# Altium project 00001-2-HAR-A-01.PrjPcb (part 2 of 2)

## Sheet SCH-00001-AC-01.SchDoc
size A4; SheetNumber: 4; SheetTotal: 4
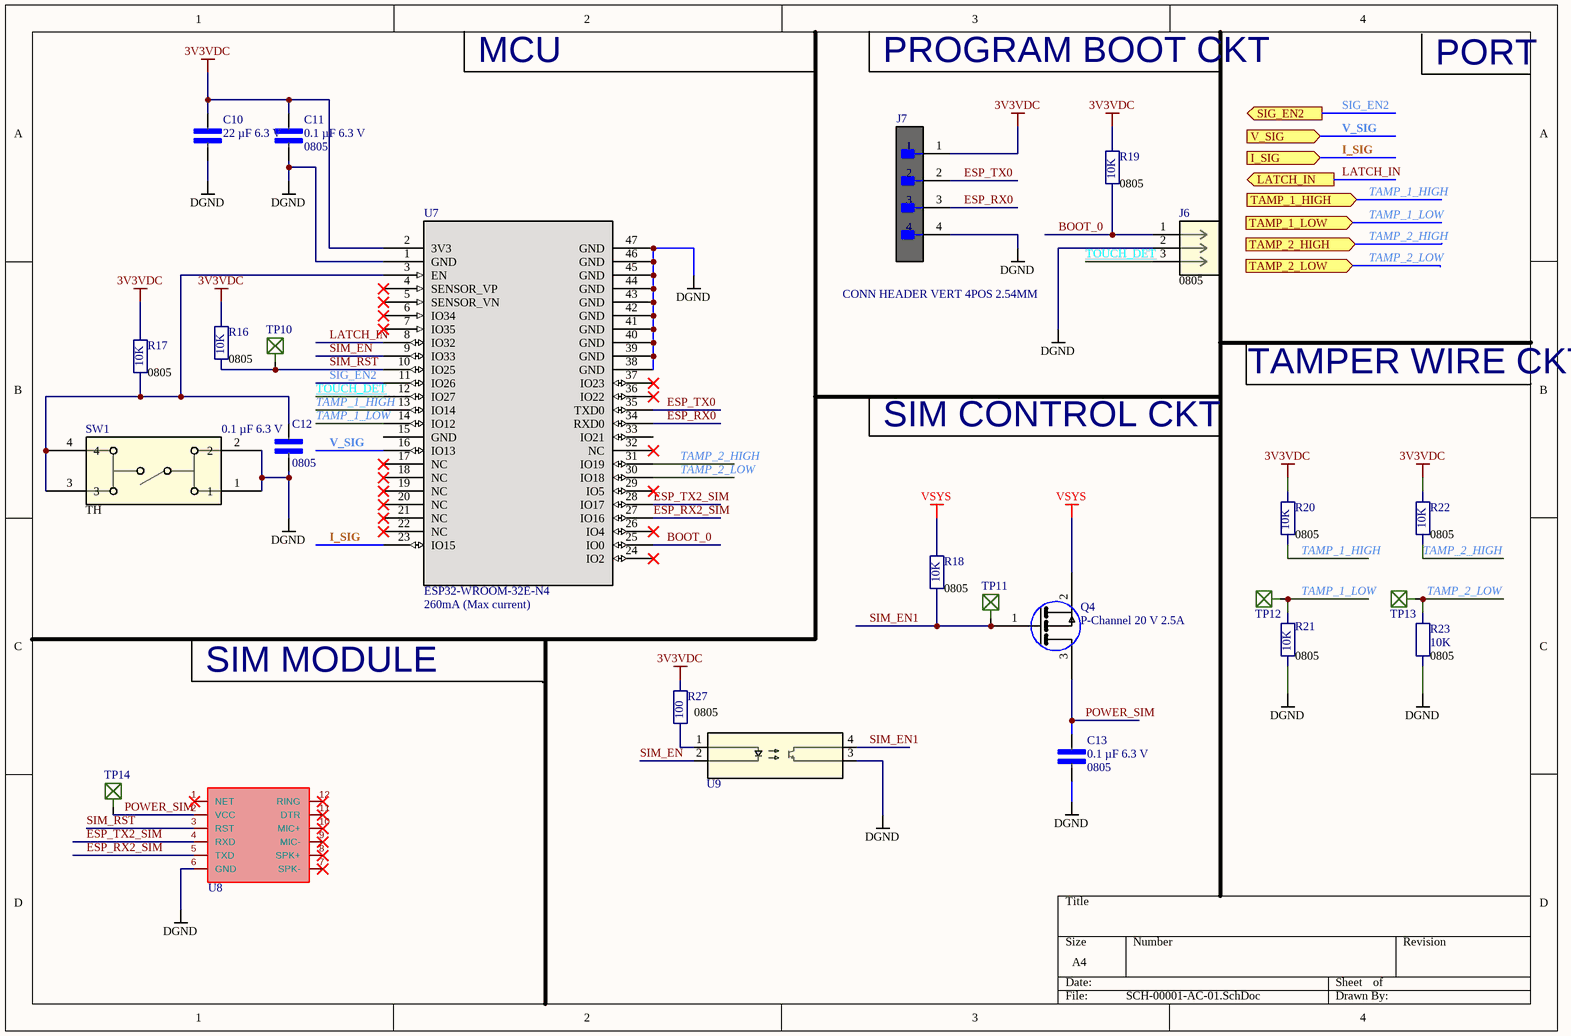
[diagram p3: SCH-00001-AC-01.SchDoc]

### Parts
C10  value 22 µF 6.3 V  [CAP0805]  (hidden comment: CL21A226KQCLRNC)
C11  value 0.1 µF 6.3 V  Value 2: 0805  [CAP0805]  (hidden comment: 08056D104KAT2A)
C12  value 0.1 µF 6.3 V  Value 2: 0805  [CAP0805]  (hidden comment: 08056D104KAT2A)
C13  value 0.1 µF 6.3 V  Value 2: 0805  [CAP0805]  (hidden comment: 08056D104KAT2A)
J6  Package: 0805  [CONN_PRPC003SAAN-RC_SUL]  (hidden comment: PRPC003SAAN-RC)
J7  value CONN HEADER VERT 4POS 2.54MM  [Amphenol_FCI_0_MFG]  (hidden comment: 68000-204HLF)
Q4  value P-Channel 20 V 2.5A  [SOT23_DMG2301U_DIO]  (hidden comment: DMG2301U-7)
R16  value 10K  Package: 0805  [RES0805]  (hidden comment: ERA-6AEB103V)
R17  value 10K  Package: 0805  [RES0805]  (hidden comment: ERA-6AEB103V)
R18  value 10K  Package: 0805  [RES0805]  (hidden comment: ERA-6AEB103V)
R19  value 10K  Package: 0805  [RES0805]  (hidden comment: ERA-6AEB103V)
R20  value 10K  Package: 0805  [RES0805]  (hidden comment: ERA-6AEB103V)
R21  value 10K  Package: 0805  [RES0805]  (hidden comment: ERA-6AEB103V)
R22  value 10K  Package: 0805  [RES0805]  (hidden comment: ERA-6AEB103V)
R23  value 10K  Package: 0805  [RES0805]  (hidden comment: ERA-6AEB103V)
R27  value 100  Package: 0805  [RES0805]  (hidden comment: ERJ-6GEYJ101V)
SW1  Package: TH  [SW4_1825910-E_TEC]  (hidden comment: 1-1825910-8)
TP10  TEST point  [TEST_POINT]  (value not drawn)
TP11  TEST point  [TEST_POINT]  (value not drawn)
TP12  TEST point  [TEST_POINT]  (value not drawn)
TP13  TEST point  [TEST_POINT]  (value not drawn)
TP14  TEST point  [TEST_POINT]  (value not drawn)
U7  Value1: 260mA (Max current)  [ESP32­WROOM­32E_EXP]  (hidden comment: ESP32-WROOM-32E-N4)
U8  SIM800L  [SIM800L-CORE]  (value not drawn)
U9  PC81710NIP1B  [SOP_PC8171_SCT-M]  (value not drawn)

### Ports
I_SIG (in, see SCH-00001-AA-01[2A], SCH-00001-AB-01[2D]), LATCH_IN (out, see SCH-00001-AA-01[2B], SCH-00001-AB-01[2D]), SIG_EN2 (out, see SCH-00001-AA-01[2B], SCH-00001-AB-01[2D]), TAMP_1_HIGH (in, see SCH-00001-AA-01[2A], SCH-00001-AB-01[2D]), TAMP_1_LOW (in, see SCH-00001-AA-01[2B], SCH-00001-AB-01[2D]), TAMP_2_HIGH (in, see SCH-00001-AA-01[2B], SCH-00001-AB-01[2D]), TAMP_2_LOW (in, see SCH-00001-AA-01[2B], SCH-00001-AB-01[2D]), V_SIG (in, see SCH-00001-AA-01[2A], SCH-00001-AB-01[2D])

### Nets
3V3VDC: C10.1(+) C11.1(+) J7.1 R16.2 R17.2 R19.2 R20.2 R22.2 R27.2 U7.2(3V3)
DGND: C10.2(-) C11.2(-) C12.2(-) C13.2(-) J6.2 J7.4 R21.1 R23.1 SW1.1 SW1.2 U7.1(GND) U7.38(GND) U7.39(GND) U7.40(GND) U7.41(GND) U7.42(GND) U7.43(GND) U7.44(GND) U7.45(GND) U7.46(GND) U7.47(GND) U8.6(GND) U9.3(EMITTER)
VSYS: Q4.2(2/S) R18.2
BOOT_0: J6.1 R19.1 U7.25(IO0)
ESP_RX0: J7.3 U7.34(RXD0)
ESP_RX2_SIM: U7.27(IO16) U8.5(TXD)
ESP_TX0: J7.2 U7.35(TXD0)
ESP_TX2_SIM: U7.28(IO17) U8.4(RXD)
I_SIG: U7.23(IO15) ; port I_SIG
LATCH_IN: U7.8(IO32) ; port LATCH_IN
POWER_SIM: C13.1(+) Q4.3(3/D) TP14.1(G) U8.2(VCC)
SIG_EN2: U7.11(IO26) ; port SIG_EN2
SIM_EN: U7.9(IO33) U9.2(CATHODE)
SIM_EN1: Q4.1(1/G) R18.1 TP11.1(G) U9.4(COLLECTOR)
SIM_RST: R16.1 TP10.1(G) U7.10(IO25) U8.3(RST)
TAMP_1_HIGH: R20.1 U7.13(IO14) ; port TAMP_1_HIGH
TAMP_1_LOW: R21.2 TP12.1(G) U7.14(IO12) ; port TAMP_1_LOW
TAMP_2_HIGH: R22.1 U7.31(IO19) ; port TAMP_2_HIGH
TAMP_2_LOW: R23.2 TP13.1(G) U7.30(IO18) ; port TAMP_2_LOW
TOUCH_DET: J6.3 U7.12(IO27)
V_SIG: U7.16(IO13) ; port V_SIG
NetC12_1: C12.1(+) R17.1 SW1.3 SW1.4 U7.3(EN)
NetR27_1: R27.1 U9.1(ANODE)

Not connected (* = marked no-connect by the designer): U7 4(SENSOR_VP)* 5(SENSOR_VN)* 6(IO34)* 7(IO35)* 15(GND) 17(NC)* 18(NC)* 19(NC)* 20(NC)* 21(NC)* 22(NC)* 24(IO2)* 26(IO4)* 29(IO5)* 32(NC)* 33(IO21) 36(IO22)* 37(IO23)*; U8 1(NET)* 7(SPK-)* 8(SPK+)* 9(MIC-)* 10(MIC+)* 11(DTR)* 12(RING)*

### Notes on the sheet
- MCU
- PROGRAM BOOT CKT
- PORT
- TAMPER WIRE CKT
- SIM CONTROL CKT
- SIM MODULE

### Library data of the parts
C10 = CL21A226KQCLRNC: 22 µF ±10% 6.3V Ceramic Capacitor X5R 0805 (2012 Metric); Manufacturer: Samsung Electro-Mechanics; FIT/NFIT: FIT; Value 2: 0805; Manufacturer Part no.: CL21A226KQCLRNC; Distributor 1: digikey; Distributor 1 Part no.: 478-08056D104KAT2ACT-ND; Price: ₹9.22; Price (Quantity): ₹2.81640100+); Date drawn: 03/9/2024; Drawn by: Varun Chakravarthy; Distributor 2: *; Distributor 2 part no.: *; Reference(datasheet): https://weblib.samsungsem.com/mlcc/mlcc-ec-data-sheet.do?partNumber=CL05Y105KP6VPN; ComponentLink1Description: Reference Product link; ComponentLink1URL: https://www.digikey.in/en/products/detail/samsung-electro-mechanics/CL21A226KQCLRNC/5961171; Supplier 1: Avnet; Supplier Part Number 1: CL21A226KQCLRNC
C11-C13 = 08056D104KAT2A: 0.1 µF ±10% 6.3V Ceramic Capacitor X5R 0805 (2012 Metric); Manufacturer: KYOCERA AVX; FIT/NFIT: FIT; Manufacturer Part no.: 08056D104KAT2A; Distributor 1: digikey; Distributor 1 Part no.: 478-08056D104KAT2ACT-ND; Price: ₹8.38; Price (Quantity): ₹2.12900(100+); Date drawn: 04/07/24; Drawn by: Varun Chakravarthy; Distributor 2: *; Distributor 2 part no.: *; Reference(datasheet): https://datasheets.kyocera-avx.com/cx5r.pdf; ComponentLink1Description: Reference Product link; ComponentLink1URL: https://www.digikey.in/en/products/detail/kyocera-avx/08056D104KAT2A/11568656; Supplier 1: Digikey; Supplier Part Number 1: 478-08056D104KAT2ACT-ND
J6 = PRPC003SAAN-RC: Connector Header Through Hole 3 position 0.100" (2.54mm); Manufacturer: Sullins Connector Solutions; Dranw by: Varun; FIT/NFIT: FIT; Manufacturer Part no.: PRPC003SAAN-RC; Distributor 1: Digikey; Distributor 1 Part no.: S1011EC-03-ND; Price: ₹36.88; Price (Quantity): ₹21.38250 (100+); Date drawn: 12/9/2024; Distributor 2: *; Distributor 2 part no.: *; Verified by: *; Reference(datasheet): https://mm.digikey.com/Volume0/opasdata/d220001/medias/docus/386/xRxCzzzSxxN-RC_ST_11635-B.pdf; ComponentLink1Description: Reference Product Link; ComponentLink1URL: https://www.digikey.in/en/products/detail/sullins-connector-solutions/PRPC003SAAN-RC/2775251?s=N4IgTCBcDaIAoCU4GEAMqDMBlAgjgcgLQLIgC6AvkA; Supplier 1: Digikey; Supplier Part Number 1: S1011EC-03-ND
J7 = 68000-204HLF: Connector Header Through Hole 4 position 0.100" (2.54mm); Manufacturer: Amphenol ICC (FCI); Dranw by: Varun; FIT/NFIT: FIT; Manufacturer Part no.: 68000-204HLF; Distributor 1: Digikey; Distributor 1 Part no.: 609-3255-ND; Price: ₹36.88; Price (Quantity): ₹20.97180 (100+); Date drawn: 3/9/2024; Distributor 2: *; Distributor 2 part no.: *; Verified by: *; Reference(datasheet): https://cdn.amphenol-cs.com/media/wysiwyg/files/documentation/datasheet/boardwiretoboard/bwb_bergstik.pdf; ComponentLink1Description: Reference Product Link; ComponentLink1URL: https://www.digikey.in/en/products/detail/amphenol-cs-fci/68000-204HLF/1878484?s=N4IgTCBcDaIGwA4AMKC0YkBYASAZAYiALoC%2BQA; Supplier 1: Avnet; Supplier Part Number 1: 28AH8822; Supplier 2: Arrow Electronics; Supplier Part Number 2: 68016-204HLF; Supplier 3: Arrow Electronics; Supplier Part Number 3: 68002-204HLF; Supplier 4: Arrow Electronics; Supplier Part Number 4: 68000-204HLF; Supplier 5: Arrow Electronics; Supplier Part Number 5: 68000-204HLF; Supplier 6: Newark; Supplier Part Number 6: 93K8020; Supplier 7: Avnet; Supplier Part Number 7: 84K6839
Q4 = DMG2301U-7: P-Channel 20 V 2.5A (Ta) 800mW (Ta) Surface Mount SOT-23-3; Manufacturer: Diodes Incorporated; FIT/NFIT: FIT; Manufacturer Part no.: DMG2301U-7; Distributor 1: digikey; Distributor 1 Part no.: DMG2301U-7DICT-ND; Price: ₹25.15; Price (Quantity): ₹9.06090(100+); Date drawn: 05/09/24; Drawn by: Varun Chakravarthy; Distributor 2: *; Distributor 2 part no.: *; Reference(datasheet): https://mm.digikey.com/Volume0/opasdata/d220001/medias/docus/645/DMG2301U.pdf; ComponentLink1Description: Reference Product Link; ComponentLink1URL: https://www.digikey.in/en/products/detail/murata-electronics/GRM21BR71A105KA01L/586695; Supplier 1: Future Electronics; Supplier Part Number 1: 5623319
R16-R23 = ERA-6AEB103V: 10 kOhms ±0.1% 0.125W, 1/8W Chip Resistor 0805 (2012 Metric) Automotive AEC-Q200 Thin Film; Manufacturer: Panasonic Electronic Components; Dranw by: Varun; FIT/NFIT: FIT; Manufacturer Part no.: ERA-6AEB103V; Distributor 1: Digikey; Distributor 1 Part no.: P10KDACT-ND; Price: ₹10.90; Price (Quantity): ₹5.89250 (100+); Date drawn: 1/9/2024; Distributor 2: *; Distributor 2 part no.: *; Verified by: *; Reference(datasheet): https://industrial.panasonic.com/cdbs/www-data/pdf/RDM0000/AOA0000C307.pdf; ComponentLink1Description: Reference Product Link; ComponentLink1URL: https://www.digikey.in/en/products/detail/panasonic-electronic-components/ERA-6AEB103V/1465773; Supplier 1: Future Electronics; Supplier Part Number 1: 5028531
R27 = ERJ-6GEYJ101V: 100 Ohms ±5% 0.125W, 1/8W Chip Resistor 0805 (2012 Metric) Automotive AEC-Q200 Thick Film; Manufacturer: Panasonic Electronic Components; Dranw by: Varun; FIT/NFIT: FIT; Manufacturer Part no.: ERJ-6GEYJ101V; Distributor 1: Digikey; Distributor 1 Part no.: P100ACT-ND; Price: ₹8.38; Price (Quantity): ₹1.76020(100+); Date drawn: 1/9/2024; Distributor 2: *; Distributor 2 part no.: *; Verified by: *; Reference(datasheet): https://industrial.panasonic.com/cdbs/www-data/pdf/RDA0000/AOA0000C301.pdf; ComponentLink1Description: Reference Product Link; ComponentLink1URL: https://www.digikey.in/en/products/detail/panasonic-electronic-components/ERJ-6GEYJ101V/89678; Supplier 1: Future Electronics; Supplier Part Number 1: 9028505
SW1 = 1-1825910-8: Tactile Switch SPST-NO Top Actuated Through Hole; Manufacturer: TE Connectivity ALCOSWITCH Switches; Dranw by: Varun; FIT/NFIT: FIT; Manufacturer Part no.: 1-1825910-8; Distributor 1: Digikey; Distributor 1 Part no.: 450-1647-ND; Price: ₹8.38; Price (Quantity): ₹6.53800(100+); Date drawn: 12/9/2024; Distributor 2: *; Distributor 2 part no.: *; Verified by: *; Reference(datasheet): https://www.te.com/usa-en/product-1-1825910-8.datasheet.pdf; ComponentLink1Description: Reference Product Link; ComponentLink1URL: https://www.digikey.in/en/products/detail/te-connectivity-alcoswitch-switches/1-1825910-8/1632533; Supplier 1: Future Electronics; Supplier Part Number 1: 3054607
TP10-TP14 = TP
U7 = ESP32-WROOM-32E-N4: Bluetooth, WiFi 802.11b/g/n, Bluetooth v4.2 +EDR, Class 1, 2 and 3 Transceiver Module 2.4GHz ~ 2.5GHz Integrated, Trace Surface Mount; Manufacturer: Espressif Systems; FIT/NFIT: FIT; Value2: 3.3V; Value: RF TXRX MOD BT BLE WIFI; Distributor 1: Digikey; Distributor 1 part no.: 1965-ESP32-WROOM-32E-N4CT-ND; Distributor 2 part no.: *; Distributor 2: *; Reference (datatsheet): https://www.espressif.com/sites/default/files/documentation/esp32-wroom-32e_esp32-wroom-32ue_datasheet_en.pdf; Drawn by: Varun; Date drawn: 2/9/2024; Verified by: *; Price: ₹209.55; Price (Quantity): ₹209.55(+100); Package: SMD; Manufacturer part no.: ESP32-WROOM-32E-N4; ComponentLink1Description: Reference Product Link; ComponentLink1URL: https://www.digikey.in/en/products/detail/espressif-systems/ESP32-WROOM-32E-N4/11613125; Supplier 1: Digikey; Supplier Part Number 1: 1965-ESP32-WROOM-32E-N4CT-ND
U8 = SIM800L: miniature cellular GSM modem; Manufacturer: SIMCOM; Dranw by: Varun; FIT/NFIT: FIT; Manufacturer Part no.: -; Distributor 1: Alibaba; Distributor 1 Part no.: *; Price: ₹100; Price (Quantity): ₹100 (100+); Date drawn: 3/9/2024; Distributor 2: *; Distributor 2 part no.: *; Verified by: *; Reference(datasheet): https://cdn-shop.adafruit.com/datasheets/sim800_series_at_command_manual_v1.01.pdf; ComponentLink1Description: Reference Product Link; ComponentLink1URL: https://www.alibaba.com/product-detail/Smallest-GSM-GPRS-Module-Quad-Band_60819714360.html?spm=a2700.7724857.0.0.28ae22d6Oz3Vcz
U9 = PC81710NIP1B: Optoisolator Transistor Output 5000Vrms 1 Channel 4-SMD; Manufacturer: SHARP/Socle Technology; Dranw by: Varun; FIT/NFIT: FIT; Manufacturer Part no.: PC81710NIP1B; Distributor 1: Digikey; Distributor 1 Part no.: 1855-1014-1-ND; Price: ₹83.82; Price (Quantity): ₹39.43730(100+); Date drawn: 05/07/24; Distributor 2: *; Distributor 2 part no.: *; Verified by: *; Reference(datasheet): http://www.socle-tech.com/doc/IC%20Channel%20Product/Optoelectronic%20Components/Photocoupler/PC8171_NIP1B_ED-16P023.pdf; ComponentLink1Description: Product link; ComponentLink1URL: https://www.digikey.in/en/products/detail/sharp-socle-technology/PC81710NIP1B/7798258; Supplier 1: Mouser; Supplier Part Number 1: 852-PC81710NIP1B

## Nets that join several sheets
3V3VDC: SCH-00001-AB-01 (5 pins), SCH-00001-AC-01 (10 pins)
DGND: SCH-00001-AB-01 (27 pins), SCH-00001-AC-01 (23 pins)
VSYS: SCH-00001-AB-01 (10 pins), SCH-00001-AC-01 (Q4.2 R18.2)
I_SIG: SCH-00001-AB-01 (R12.2 R13.2 TP3.1), SCH-00001-AC-01 (U7.23)
LATCH_IN: SCH-00001-AB-01 (U10.2), SCH-00001-AC-01 (U7.8)
SIG_EN2: SCH-00001-AB-01 (D1.2 R25.2 TP8.1), SCH-00001-AC-01 (U7.11)
TAMP_1_HIGH: SCH-00001-AB-01 (J4.1), SCH-00001-AC-01 (R20.1 U7.13)
TAMP_1_LOW: SCH-00001-AB-01 (J4.2), SCH-00001-AC-01 (R21.2 TP12.1 U7.14)
TAMP_2_HIGH: SCH-00001-AB-01 (J5.1), SCH-00001-AC-01 (R22.1 U7.31)
TAMP_2_LOW: SCH-00001-AB-01 (J5.2), SCH-00001-AC-01 (R23.2 TP13.1 U7.30)
V_SIG: SCH-00001-AB-01 (C9.1 R15.1 TP4.1 U6.5), SCH-00001-AC-01 (U7.16)